# Altium schematic sheet USB.SchDoc
size A4; Organization: Altium Limited; Address1: L3, 12a Rodborough Rd; Address2: Frenchs Forest; Address3: NSW; Address4: Australia 2086
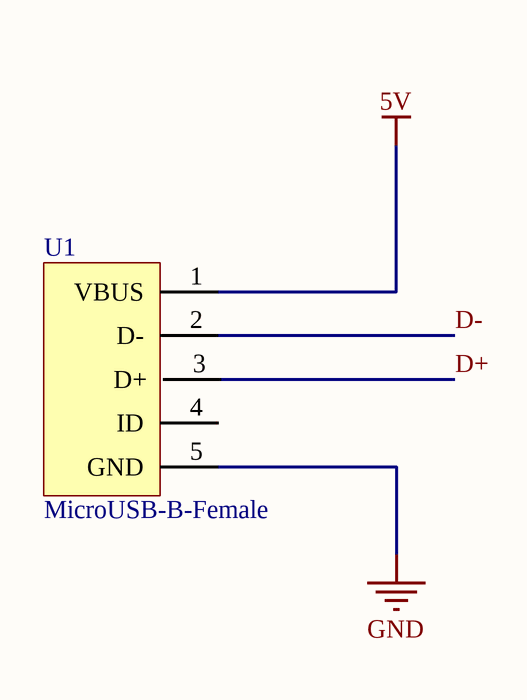
[diagram p0: USB.SchDoc]

## Parts
U1  MicroUSB-B-Female  [Micro-USB-B-Female]

## Nets
5V: U1.1(VBUS)
GND: U1.5(GND)
D+: U1.3(D+)
D-: U1.2(D-)

Not connected (* = marked no-connect by the designer): U1 4(ID)

## Notes on the sheet
- Title
- Size:
- Date:
- A4
- Number:
- Time:
- Revision:
- Sheet
- of
- File: